# Altium schematic sheet Snd2Light.SchDoc
size A4; Organization: Altium Limited; Address1: 3 Minna Close; Address2: Belrose; Address3: NSW 2086; Address4: Australia
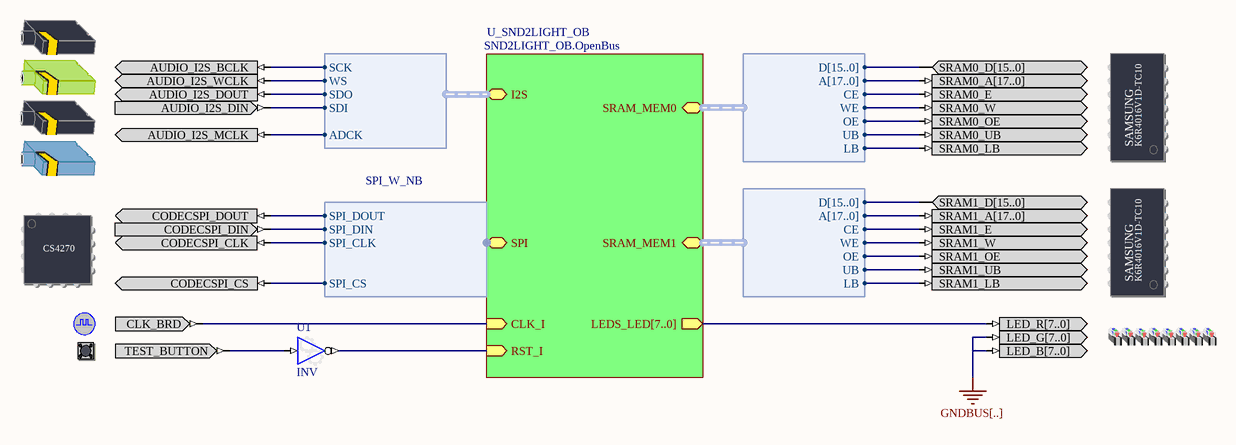
[diagram p0: Snd2Light.SchDoc]

## Parts
(Parts that share a designator on the sheet are numbered #1, #2 ... from top to bottom, then left to right.)
?#1  SRAM_DAUGHTER0  (value not drawn)
?#2  AUDIO_CODEC  (value not drawn)
?#3  SRAM_DAUGHTER1  (value not drawn)
?#4  AUDIO_CODEC_CTRL  (value not drawn)
?#5  CLOCK_BOARD  (value not drawn)
?#6  LEDS_RGB  (value not drawn)
?#7  TEST_BUTTON  (value not drawn)
U1  INV

## Sub-sheets
U_SND2LIGHT_OB = SND2LIGHT_OB.OpenBus: RST_I (in), CLK_I (in), SRAM_MEM0 (harness WB_MEM_CTRL_SRAM16_A18), SRAM_MEM1 (harness WB_MEM_CTRL_SRAM16_A18), LEDS_LED[7..0] (out), I2S (harness I2S_W_Both), SPI (harness SPI_W_NB)

## Harnesses
WB_MEM_CTRL_SRAM16_A18: D[15..0], A[17..0], CE, WE, OE, UB, LB
I2S_W_Both: SCK, WS, SDO, SDI, ADCK
SPI_W_NB: SPI_DOUT, SPI_DIN, SPI_CLK, SPI_CS

## Nets
GNDBUS[..]: ?#6.LED_B[7..0] ?#6.LED_G[7..0]
Net?#1_SRAM0_A[17..0]: ?#1.SRAM0_A[17..0] ; sheet U_SND2LIGHT_OB/SRAM_MEM0.A[17..0]
Net?#1_SRAM0_D[15..0]: ?#1.SRAM0_D[15..0] ; sheet U_SND2LIGHT_OB/SRAM_MEM0.D[15..0]
Net?#1_SRAM0_E: ?#1.SRAM0_E ; sheet U_SND2LIGHT_OB/SRAM_MEM0.CE
Net?#1_SRAM0_LB: ?#1.SRAM0_LB ; sheet U_SND2LIGHT_OB/SRAM_MEM0.LB
Net?#1_SRAM0_OE: ?#1.SRAM0_OE ; sheet U_SND2LIGHT_OB/SRAM_MEM0.OE
Net?#1_SRAM0_UB: ?#1.SRAM0_UB ; sheet U_SND2LIGHT_OB/SRAM_MEM0.UB
Net?#1_SRAM0_W: ?#1.SRAM0_W ; sheet U_SND2LIGHT_OB/SRAM_MEM0.WE
Net?#2_AUDIO_I2S_BCLK: ?#2.AUDIO_I2S_BCLK ; sheet U_SND2LIGHT_OB/I2S.SCK
Net?#2_AUDIO_I2S_DIN: ?#2.AUDIO_I2S_DIN ; sheet U_SND2LIGHT_OB/I2S.SDI
Net?#2_AUDIO_I2S_DOUT: ?#2.AUDIO_I2S_DOUT ; sheet U_SND2LIGHT_OB/I2S.SDO
Net?#2_AUDIO_I2S_MCLK: ?#2.AUDIO_I2S_MCLK ; sheet U_SND2LIGHT_OB/I2S.ADCK
Net?#2_AUDIO_I2S_WCLK: ?#2.AUDIO_I2S_WCLK ; sheet U_SND2LIGHT_OB/I2S.WS
Net?#3_SRAM1_A[17..0]: ?#3.SRAM1_A[17..0] ; sheet U_SND2LIGHT_OB/SRAM_MEM1.A[17..0]
Net?#3_SRAM1_D[15..0]: ?#3.SRAM1_D[15..0] ; sheet U_SND2LIGHT_OB/SRAM_MEM1.D[15..0]
Net?#3_SRAM1_E: ?#3.SRAM1_E ; sheet U_SND2LIGHT_OB/SRAM_MEM1.CE
Net?#3_SRAM1_LB: ?#3.SRAM1_LB ; sheet U_SND2LIGHT_OB/SRAM_MEM1.LB
Net?#3_SRAM1_OE: ?#3.SRAM1_OE ; sheet U_SND2LIGHT_OB/SRAM_MEM1.OE
Net?#3_SRAM1_UB: ?#3.SRAM1_UB ; sheet U_SND2LIGHT_OB/SRAM_MEM1.UB
Net?#3_SRAM1_W: ?#3.SRAM1_W ; sheet U_SND2LIGHT_OB/SRAM_MEM1.WE
Net?#4_CODECSPI_CLK: ?#4.CODECSPI_CLK ; sheet U_SND2LIGHT_OB/SPI.SPI_CLK
Net?#4_CODECSPI_CS: ?#4.CODECSPI_CS ; sheet U_SND2LIGHT_OB/SPI.SPI_CS
Net?#4_CODECSPI_DIN: ?#4.CODECSPI_DIN ; sheet U_SND2LIGHT_OB/SPI.SPI_DIN
Net?#4_CODECSPI_DOUT: ?#4.CODECSPI_DOUT ; sheet U_SND2LIGHT_OB/SPI.SPI_DOUT
Net?#5_CLK_BRD: ?#5.CLK_BRD ; sheet U_SND2LIGHT_OB/CLK_I
Net?#6_LED_R[7..0]: ?#6.LED_R[7..0] ; sheet U_SND2LIGHT_OB/LEDS_LED[7..0]
Net?#7_TEST_BUTTON: ?#7.TEST_BUTTON U1.I
NetU1_O: U1.O ; sheet U_SND2LIGHT_OB/RST_I

## Notes on the sheet
- (in symbol AUDIO_CODEC_CTRL) CS4270
- (in symbol SRAM_DAUGHTER0) SAMSUNG; K6R4016V1D-TC10
- (in symbol SRAM_DAUGHTER1) SAMSUNG; K6R4016V1D-TC10

## Library data of the parts
?#1 = SRAM_DAUGHTER0: Free Static RAM - Daughterboard; PortComponent: True; Published: 14-May-2007; Publisher: Altium Limited; HelpURL: TR0143 NanoBoard Technical Reference Manual - NB2.pdf#page=24
?#2 = AUDIO_CODEC: Audio Codec; PortComponent: True; IncludeInDSF: AUDIO_CS4270; Published: 22-Jan-2007; Publisher: Altium Limited; HelpURL: https://wiki.altium.com/display/ADOH/NanoBoard+3000+-+Audio+CODEC
?#3 = SRAM_DAUGHTER1: Free Static RAM - Daughterboard; PortComponent: True; Published: 14-May-2007; Publisher: Altium Limited; HelpURL: TR0143 NanoBoard Technical Reference Manual - NB2.pdf#page=24
?#4 = AUDIO_CODEC_CTRL: Audio Codec Control; PortComponent: True; Published: 22-Jan-2007; Publisher: Altium Limited; HelpURL: https://wiki.altium.com/display/ADOH/NanoBoard+3000+-+Audio+CODEC
?#5 = CLOCK_BOARD: Global System Clock Supply; PortComponent: True; Published: 19-Nov-2003; Publisher: Altium Limited; HelpURL: https://wiki.altium.com/display/ADOH/NB2DSK01+-+System+Clocks; UseInDSF: True
?#6 = LEDS_RGB: LEDS RGB; PortComponent: True; Published: 11-Mar-2009; Publisher: Altium Limited
?#7 = TEST_BUTTON: Test / Reset Button; PortComponent: True; Published: 19-Nov-2003; Publisher: Altium Limited; HelpURL: TR0143 Technical Reference Manual for Altium's Desktop NanoBoard NB2DSK01.pdf#page=53
U1 = INV: Configurable Inverter; ConfigurationParameters: {}Version[1.1]{}SignalCount[1]{}SignalWidth0[1]{}OutputOption0[Inverted]{}EnableMode[None]{}ShowPinNames[False]{}; ConfiguratorName: GENERIC_BUFFER; LastRevisionNo: 1.00.00; Published: 10-Oct-2008; Publisher: Altium Limited; HelpURL: https://wiki.altium.com/display/ADOH/Configurable+Generic+Library